# EAGLE design 5S (EAGLE 7.6.0)

## Sheet 1 of 2: uC
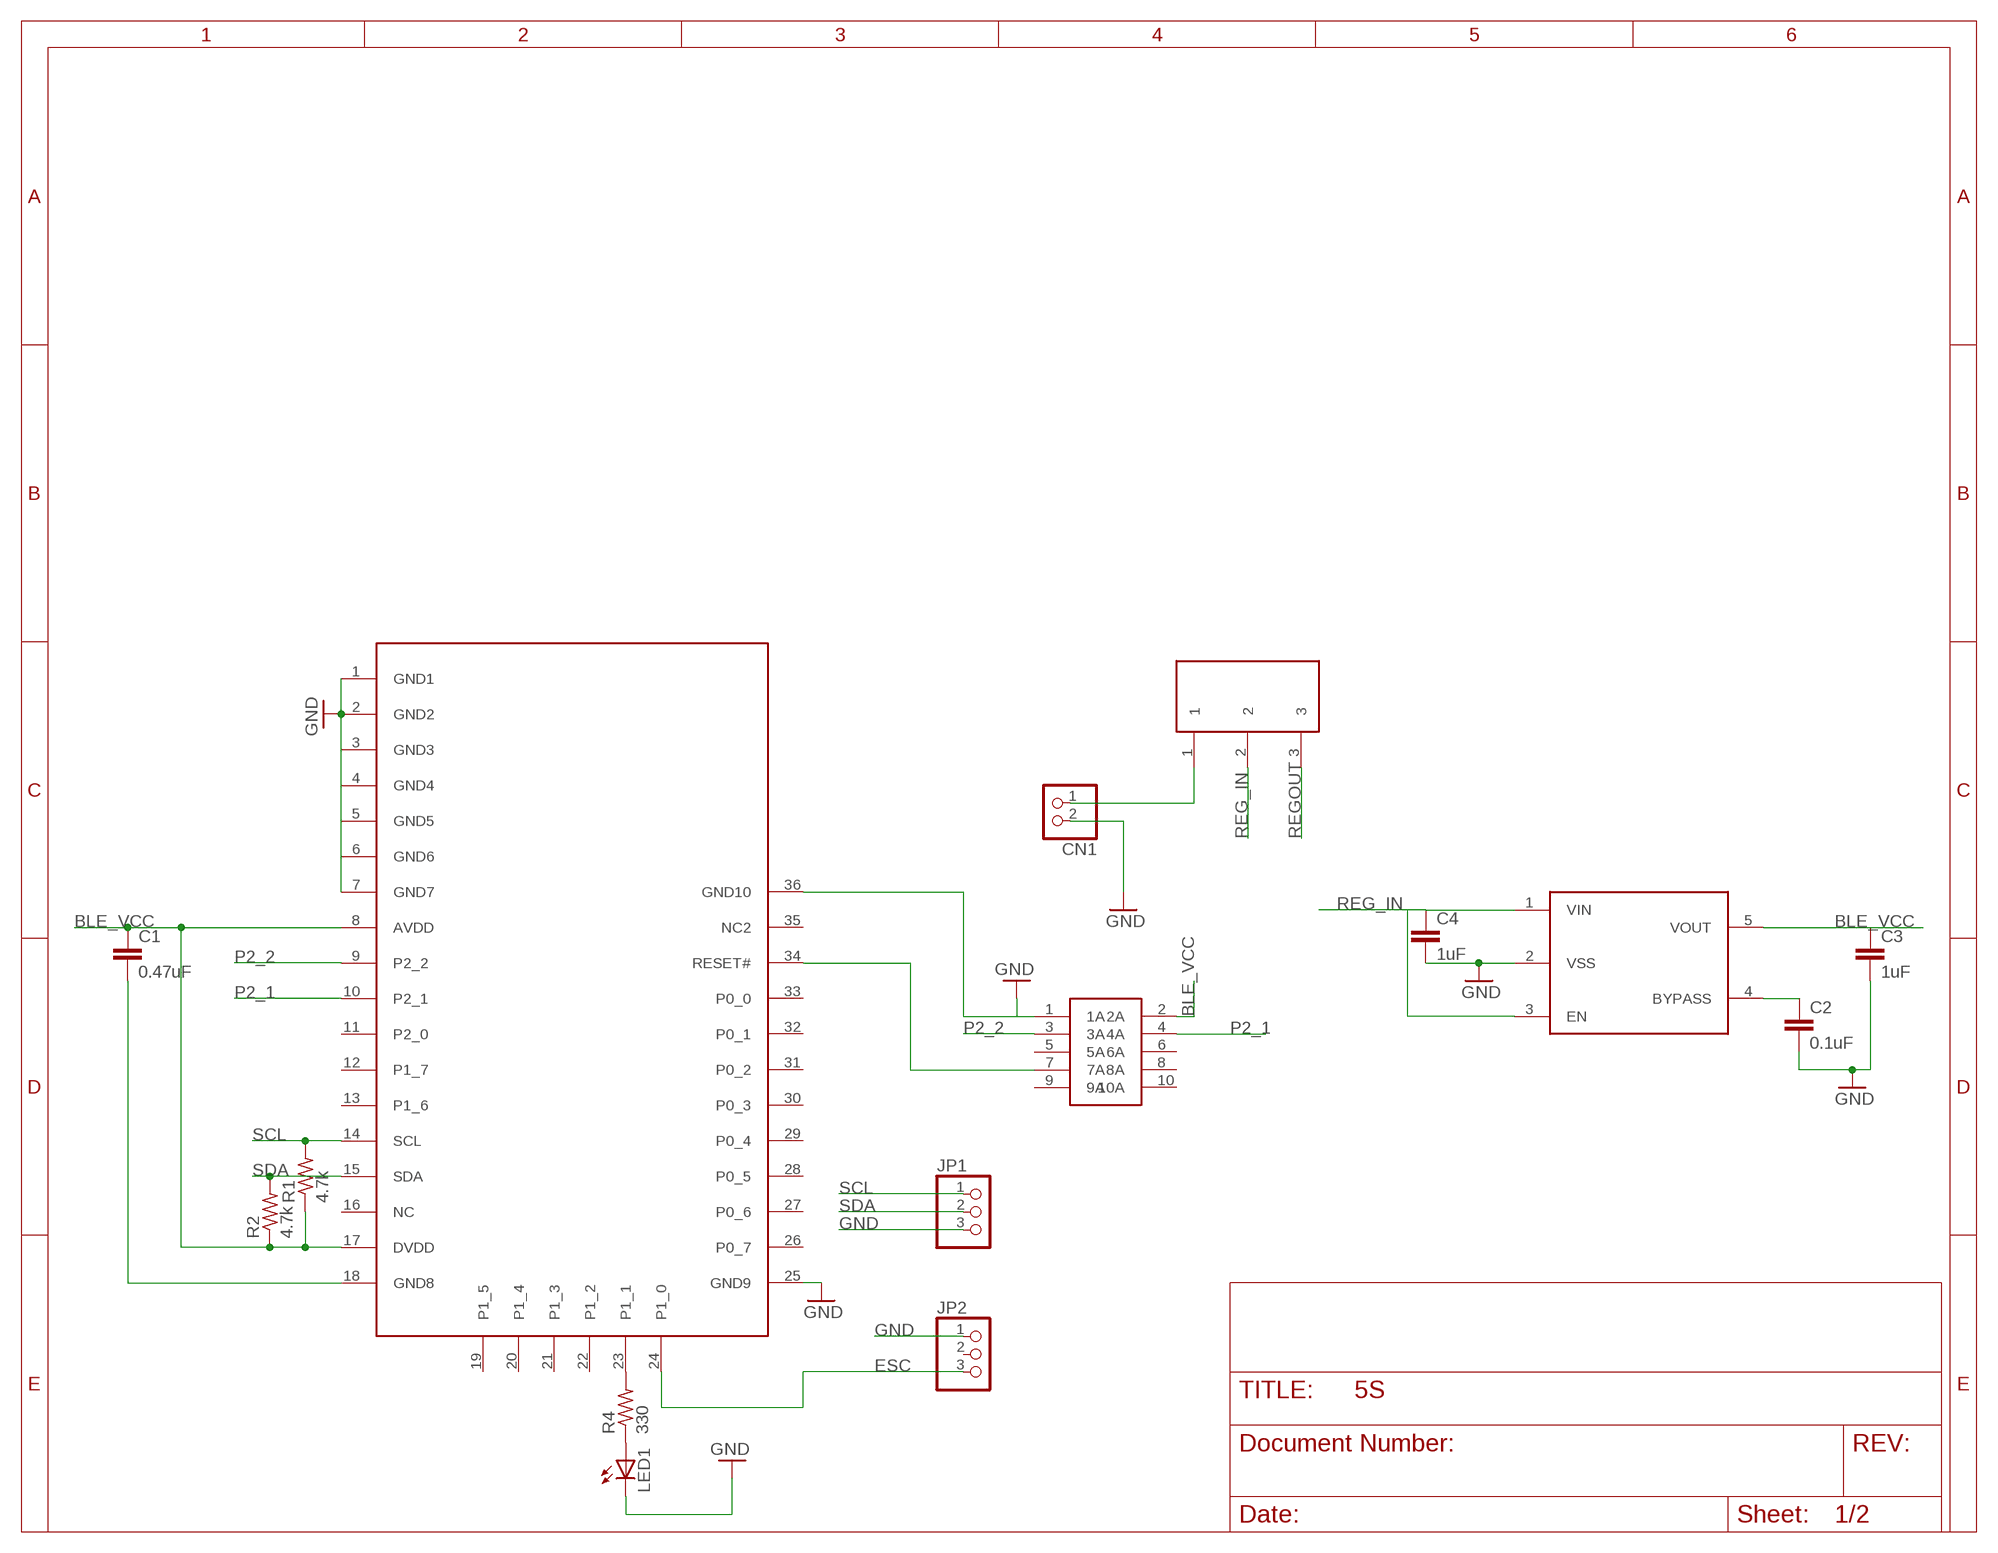
[diagram p0: schematic, sheet 1]

### Parts
C1  0.47uF  C-EUC0402  [C0402]
C2  0.1uF  C-EUC0402  [C0402]
C3  1uF  C-EUC0402  [C0402]
C4  1uF  C-EUC0402  [C0402]
CN1  JST_2PIN-THM  [JST-PH-2-THM]
JP1  PINHD-1X3  [1X03]
JP2  PINHD-1X3  [1X03]
LED1  LEDCHIP-LED0805  [CHIP-LED0805]
R1  4.7k  R-US_R0402  [R0402]
R2  4.7k  R-US_R0402  [R0402]
R4  330  R-US_R0402  [R0402]
U$1  BLE113  [BLUEGIGA]
U$2  RIBBON_10POS_MALE  [RIBBON_10POS_MALE]
U$4  SPDT_THRU  [SPDT_THRU]
U$5  LP3985  [SOT23-5L]

### Nets
BLE_VCC: C1.1 C3.1 R1.1 R2.1 U$1.8(AVDD) U$1.17(DVDD) U$2.2(2A) U$5.5(VOUT)
ESC: JP2.3 U$1.24(P1_0)
GND: C2.2 C3.2 C4.2 CN1.2 JP1.3 JP2.1 LED1.C U$1.1(GND1) U$1.2(GND2) U$1.3(GND3) U$1.4(GND4) U$1.5(GND5) U$1.6(GND6) U$1.7(GND7) U$1.25(GND9) U$1.36(GND10) U$2.1(1A) U$5.2(VSS) ; also sheet 2
N$1: U$1.34(RESET#) U$2.7(7A)
N$2: CN1.1 U$4.1
N$4: C1.2 U$1.18(GND8)
N$7: R4.2 U$1.23(P1_1)
N$8: C2.1 U$5.4(BYPASS)
N$9: LED1.A R4.1
P2_1: U$1.10(P2_1) U$2.4(4A)
P2_2: U$1.9(P2_2) U$2.3(3A)
REG_IN: C4.1 U$4.2 U$5.1(VIN) U$5.3(EN)
REGOUT: U$4.3 ; also sheet 2
SCL: JP1.1 R1.2 U$1.14(SCL) ; also sheet 2
SDA: JP1.2 R2.2 U$1.15(SDA) ; also sheet 2
Unconnected: JP2.2 U$1.11(P2_0) U$1.12(P1_7) U$1.13(P1_6) U$1.16(NC) U$1.19(P1_5) U$1.20(P1_4) U$1.21(P1_3) U$1.22(P1_2) U$1.26(P0_7) U$1.27(P0_6) U$1.28(P0_5) U$1.29(P0_4) U$1.30(P0_3) U$1.31(P0_2) U$1.32(P0_1) U$1.33(P0_0) U$1.35(NC2) U$2.5(5A) U$2.6(6A) U$2.8(8A) U$2.9(9A) U$2.10(10A)

## Sheet 2 of 2: Charge
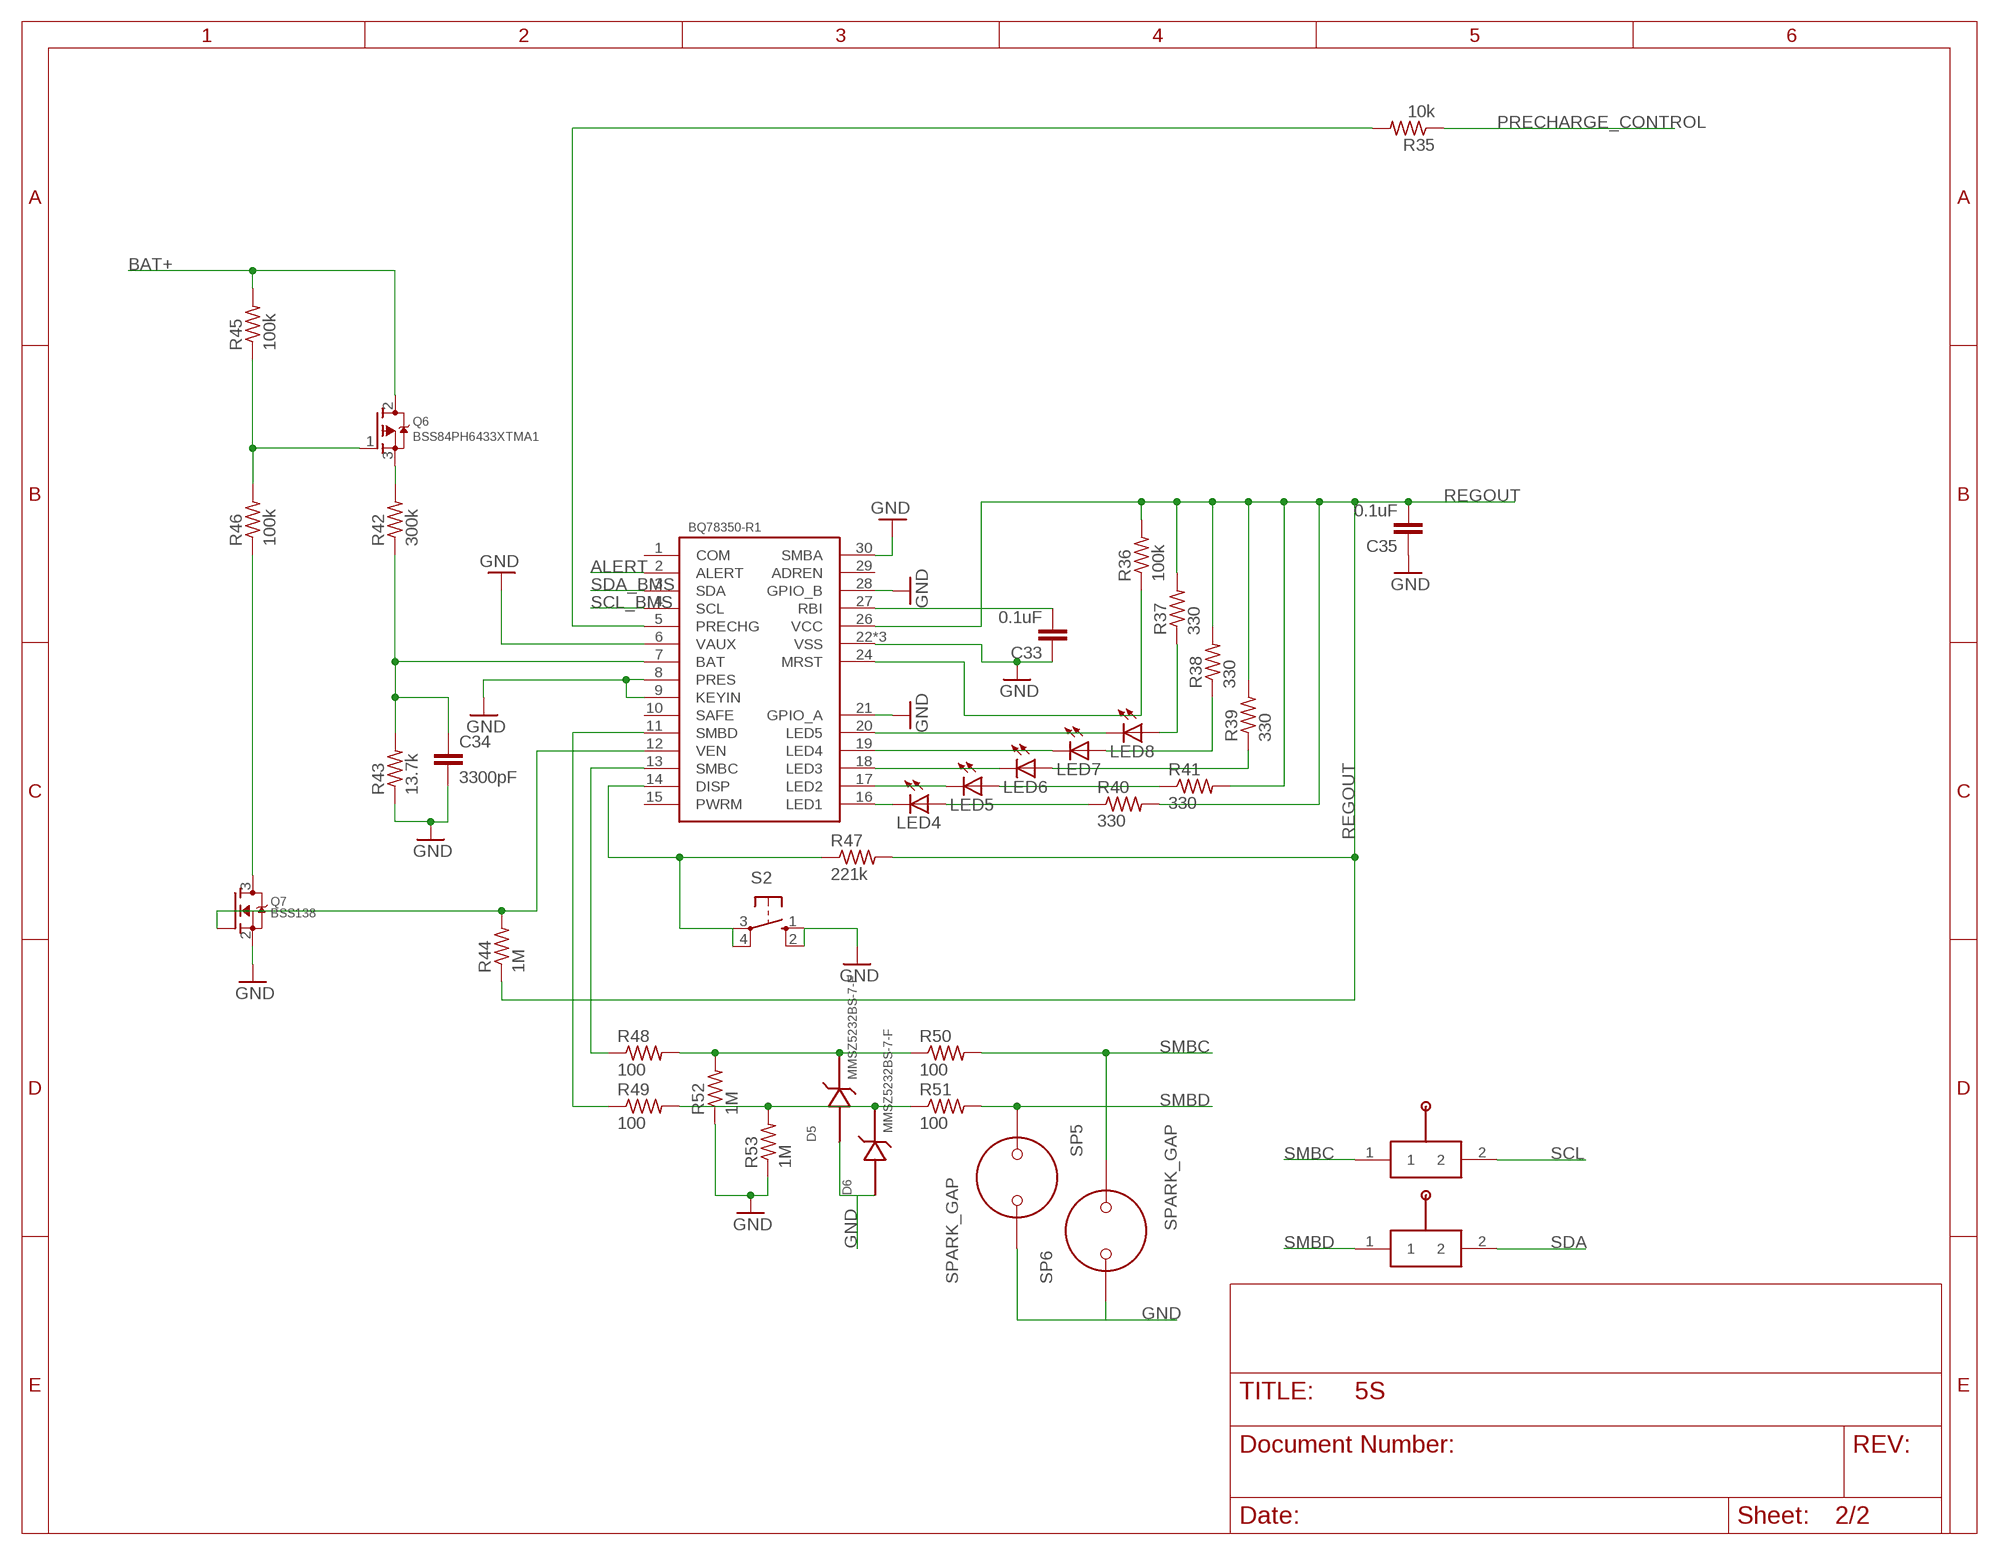
[diagram p1: schematic, sheet 2, part 1 of 2]
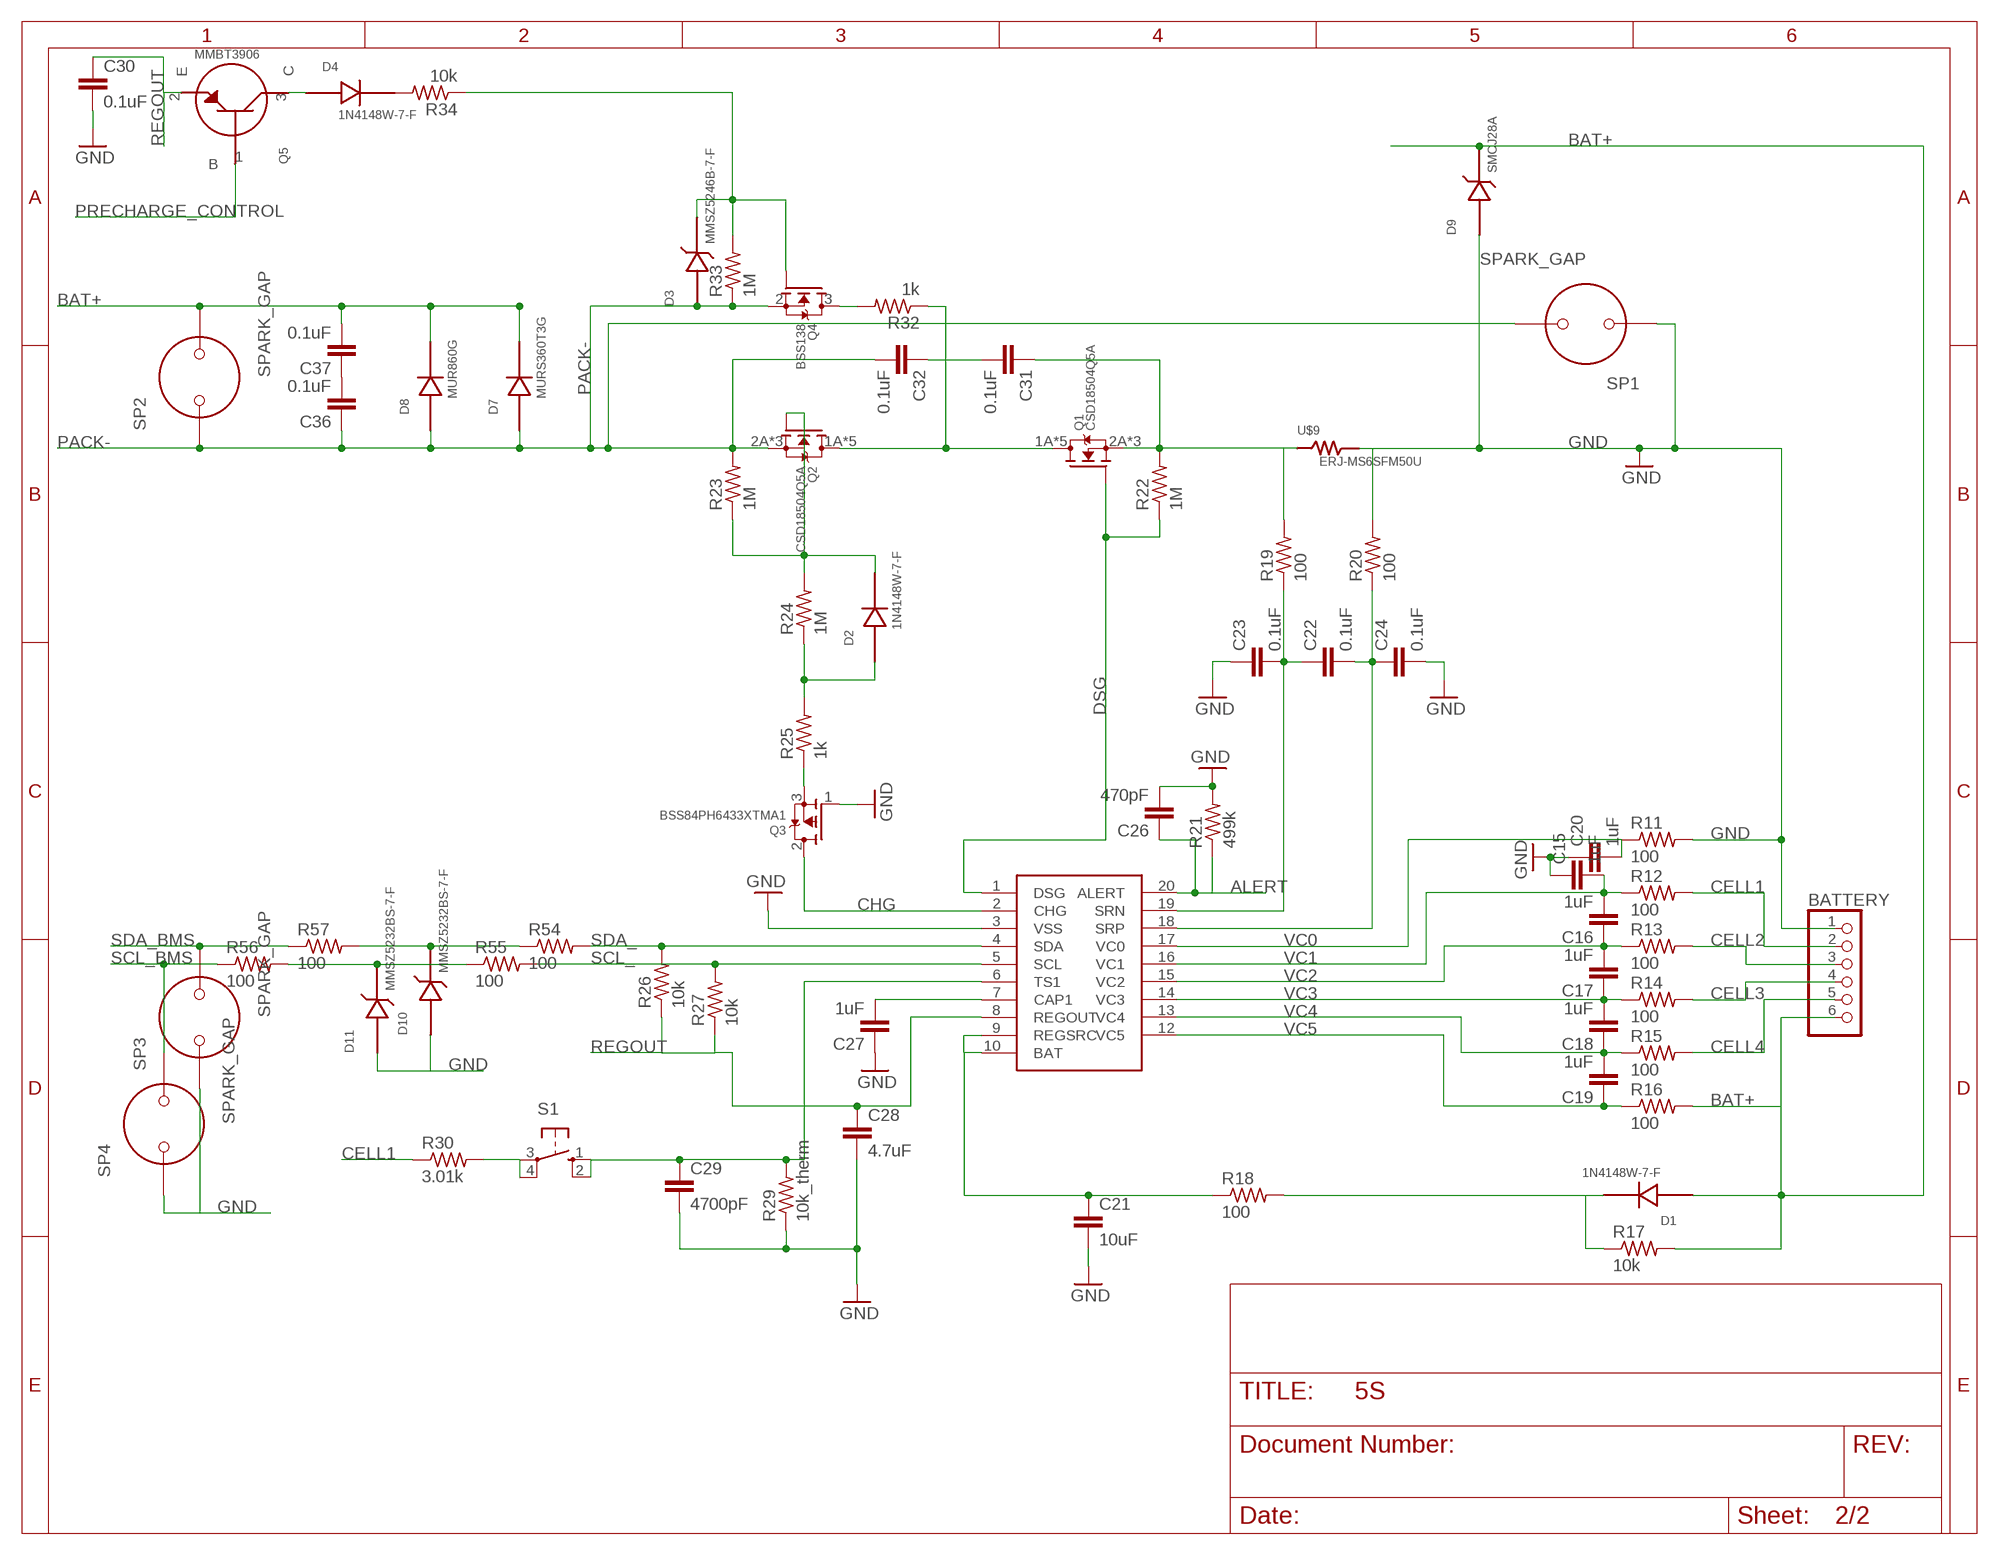
[diagram p2: schematic, sheet 2, part 2 of 2]

### Parts
BATTERY  PINHD-1X6  [1X06]
C15  1uF  C-EUC0805  [C0805]
C16  1uF  C-EUC0805  [C0805]
C17  1uF  C-EUC0805  [C0805]
C18  1uF  C-EUC0805  [C0805]
C19  1uF  C-EUC0805  [C0805]
C20  1uF  C-EUC0805  [C0805]
C21  10uF  C-EUC1206  [C1206]
C22  0.1uF  C-EUC0805  [C0805]
C23  0.1uF  C-EUC0805  [C0805]
C24  0.1uF  C-EUC0805  [C0805]
C26  470pF  C-EUC0805  [C0805]
C27  1uF  C-EUC0805  [C0805]
C28  4.7uF  C-EUC0805  [C0805]
C29  4700pF  C-EUC0402  [C0402]
C30  0.1uF  C-EUC0805  [C0805]
C31  0.1uF  C-EUC0805  [C0805]
C32  0.1uF  C-EUC0805  [C0805]
C33  0.1uF  C-EUC0805  [C0805]
C34  3300pF  C-EUC0402  [C0402]
C35  0.1uF  C-EUC0805  [C0805]
C36  0.1uF  C-EUC0805  [C0805]
C37  0.1uF  C-EUC0805  [C0805]
D1  1N4148W-7-F  [SOD-123]
D2  1N4148W-7-F  [SOD-123]
D3  MMSZ5246B-7-F  [SOD-123]
D4  1N4148W-7-F  [SOD-123]
D5  MMSZ5232BS-7-F  [SOD-323F]
D6  MMSZ5232BS-7-F  [SOD-323F]
D7  MURS360T3G  [SMC(DO-214AB)]
D8  MUR860G  [TO-220(2RA)]
D9  SMCJ28A  [SMC(DO-214AB)]
D10  MMSZ5232BS-7-F  [SOD-323F]
D11  MMSZ5232BS-7-F  [SOD-323F]
LED4  LEDCHIPLED_0805  [CHIPLED_0805]
LED5  LEDCHIPLED_0805  [CHIPLED_0805]
LED6  LEDCHIPLED_0805  [CHIPLED_0805]
LED7  LEDCHIPLED_0805  [CHIPLED_0805]
LED8  LEDCHIPLED_0805  [CHIPLED_0805]
Q1  CSD18504Q5A  [Q5A]
Q2  CSD18504Q5A  [Q5A]
Q3  BSS84PH6433XTMA1  [SOT23-3]
Q4  BSS138  [SOT23-3]
Q5  MMBT3906  [SOT23-3]
Q6  BSS84PH6433XTMA1  [SOT23-3]
Q7  BSS138  [SOT23-3]
R11  100  R-US_R1206  [R1206]
R12  100  R-US_R1206  [R1206]
R13  100  R-US_R1206  [R1206]
R14  100  R-US_R1206  [R1206]
R15  100  R-US_R1206  [R1206]
R16  100  R-US_R1206  [R1206]
R17  10k  R-US_R0805  [R0805]
R18  100  R-US_R0805  [R0805]
R19  100  R-US_R0805  [R0805]
R20  100  R-US_R0805  [R0805]
R21  499k  R-US_R0805  [R0805]
R22  1M  R-US_R1206  [R1206]
R23  1M  R-US_R1206  [R1206]
R24  1M  R-US_R1206  [R1206]
R25  1k  R-US_R0805  [R0805]
R26  10k  R-US_R0805  [R0805]
R27  10k  R-US_R0805  [R0805]
R29  10k_therm  R-US_R0402  [R0402]
R30  3.01k  R-US_R0805  [R0805]
R32  1k  R-US_R2512  [R2512]
R33  1M  R-US_R1206  [R1206]
R34  10k  R-US_R0805  [R0805]
R35  10k  R-US_R0805  [R0805]
R36  100k  R-US_R0805  [R0805]
R37  330  R-US_R0402  [R0402]
R38  330  R-US_R0402  [R0402]
R39  330  R-US_R0402  [R0402]
R40  330  R-US_R0402  [R0402]
R41  330  R-US_R0402  [R0402]
R42  300k  R-US_R0805  [R0805]
R43  13.7k  R-US_R0805  [R0805]
R44  1M  R-US_R1206  [R1206]
R45  100k  R-US_R0805  [R0805]
R46  100k  R-US_R0805  [R0805]
R47  221k  R-US_R0805  [R0805]
R48  100  R-US_R0805  [R0805]
R49  100  R-US_R0805  [R0805]
R50  100  R-US_R0805  [R0805]
R51  100  R-US_R0805  [R0805]
R52  1M  R-US_R1206  [R1206]
R53  1M  R-US_R1206  [R1206]
R54  100  R-US_R0805  [R0805]
R55  100  R-US_R0805  [R0805]
R56  100  R-US_R0805  [R0805]
R57  100  R-US_R0805  [R0805]
S1  10-XX  [B3F-10XX]
S2  10-XX  [B3F-10XX]
SP1  SPARK_GAP  [SPARK_GAP]
SP2  SPARK_GAP  [SPARK_GAP]
SP3  SPARK_GAP  [SPARK_GAP]
SP4  SPARK_GAP  [SPARK_GAP]
SP5  SPARK_GAP  [SPARK_GAP]
SP6  SPARK_GAP  [SPARK_GAP]
U$3  BQ76920  [SOIC-20]
U$9  ERJ-MS6SFM50U  [ERJ-MS6SFM50U]
U$10  BQ78350-R1  [SOIC-30]
U$16  MANUAL_SWITCH  [MANUAL_SWITCH]
U$17  MANUAL_SWITCH  [MANUAL_SWITCH]

### Nets
ALERT: C26.1 R21.1 U$3.20(ALERT) U$10.2(ALERT)
BAT+: BATTERY.6 C37.2 D1.P$1 D7.2 D8.P$3 D9.2 Q6.2(S) R16.2 R17.2 R45.2 SP2.P$2
CELL1: BATTERY.2 R12.2 R30.1
CELL2: BATTERY.3 R13.2
CELL3: BATTERY.4 R14.2
CELL4: BATTERY.5 R15.2
CHG: Q3.2(S) U$3.2(CHG)
DSG: Q1.3A(G) R22.1 U$3.1(DSG)
GND: BATTERY.1 C15.1 C20.1 C21.2 C23.1 C24.2 C26.2 C27.1 C28.2 C29.2 C30.2 C33.1 C34.2 C35.1 D5.1 D6.1 D9.1 D10.1 D11.1 Q3.1(G) Q7.2(S) R11.2 R20.2 R21.2 R29.1 R43.1 R52.1 R53.1 S2.1(S) S2.2(S1) SP1.P$1 SP3.P$1 SP4.P$1 SP5.P$2 SP6.P$1 U$3.3(VSS) U$9.2 U$10.6(VAUX) U$10.8(PRES) U$10.9(KEYIN) U$10.21(GPIO_A) U$10.22(VSS) U$10.23(VSS) U$10.25(VSS) U$10.28(GPIO_B) U$10.30(SMBA) ; also sheet 1
N$15: C21.1 R18.1 U$3.9(REGSRC) U$3.10(BAT)
N$16: C22.2 C24.1 R20.1 U$3.18(SRP)
N$17: D1.P$2 R17.1 R18.2
N$18: D11.2 R55.1 R56.2
N$19: C31.1 Q1.2A(S) Q1.2B(S) Q1.2C(S) R19.2 R22.2 U$9.1
N$20: C22.1 C23.2 R19.1 U$3.19(SRN)
N$21: C27.2 U$3.7(CAP1)
N$22: Q4.3(D) R32.2
N$23: D4.P$2 R34.2
N$24: D3.P$2 Q4.1(G) R33.2 R34.1
N$25: D4.P$1 Q5.3(C)
N$27: D2.P$1 R24.1 R25.2
N$28: Q1.1A(D) Q1.1B(D) Q1.1C(D) Q1.1D(D) Q1.1E(D) Q2.1A(D) Q2.1B(D) Q2.1C(D) Q2.1D(D) Q2.1E(D) R32.1
N$29: C36.2 C37.1
N$30: D2.P$2 Q2.3A(G) R23.1 R24.2
N$31: Q3.3(D) R25.1
N$32: R30.2 S1.3(P) S1.4(P1)
N$33: C29.1 R29.2 S1.1(S) S1.2(S1) U$3.6(TS1)
N$35: C31.2 C32.1
N$36: C33.2 U$10.27(RBI)
N$37: R35.2 U$10.5(PRECHG)
N$38: R36.1 U$10.24(MRST)
N$39: Q7.3(D) R46.1
N$40: LED8.C U$10.20(LED5)
N$41: LED7.C U$10.19(LED4)
N$42: LED6.C U$10.18(LED3)
N$43: LED5.C U$10.17(LED2)
N$44: LED4.C U$10.16(LED1)
N$45: LED4.A R40.1
N$46: LED5.A R41.1
N$47: LED6.A R39.1
N$48: LED7.A R38.1
N$49: LED8.A R37.1
N$50: C34.1 R42.1 R43.2 U$10.7(BAT)
N$51: Q7.1(G) R44.2 U$10.12(VEN)
N$52: Q6.3(D) R42.2
N$53: Q6.1(G) R45.1 R46.2
N$54: R48.1 U$10.13(SMBC)
N$55: R47.1 S2.3(P) S2.4(P1) U$10.14(DISP)
N$56: R49.1 U$10.11(SMBD)
N$57: D5.2 R48.2 R50.1 R52.2
N$58: D6.2 R49.2 R51.1 R53.2
N$59: D10.2 R54.1 R57.2
PACK-: C32.2 C36.1 D3.P$1 D7.1 D8.P$1 Q2.2A(S) Q2.2B(S) Q2.2C(S) Q4.2(S) R23.2 R33.1 SP1.P$2 SP2.P$1
PRECHARGE_CONTROL: Q5.1(B) R35.1
REGOUT: C28.1 C30.1 C35.2 Q5.2(E) R26.1 R27.1 R36.2 R37.2 R38.2 R39.2 R40.2 R41.2 R44.1 R47.2 U$3.8(REGOUT) U$10.26(VCC) ; also sheet 1
SCL: U$16.2 ; also sheet 1
SCL_: R27.2 R55.2 U$3.5(SCL)
SCL_BMS: R56.1 SP4.P$2 U$10.4(SCL)
SDA: U$17.2 ; also sheet 1
SDA_: R26.2 R54.2 U$3.4(SDA)
SDA_BMS: R57.1 SP3.P$2 U$10.3(SDA)
SMBC: R50.2 SP6.P$2 U$16.1
SMBD: R51.2 SP5.P$1 U$17.1
VC0: C20.2 R11.1 U$3.17(VC0)
VC1: C15.2 C16.2 R12.1 U$3.16(VC1)
VC2: C16.1 C17.2 R13.1 U$3.15(VC2)
VC3: C17.1 C18.2 R14.1 U$3.14(VC3)
VC4: C18.1 C19.2 R15.1 U$3.13(VC4)
VC5: C19.1 R16.1 U$3.12(VC5)
Unconnected: U$10.1(COM) U$10.10(SAFE) U$10.15(PWRM) U$10.29(ADREN)

## Library data of the parts
BATTERY = adafruit:PINHD-1X6: PIN HEADER
C1-C4 C15-C24 C26-C37 = rcl:C-EU: CAPACITOR, European symbol
CN1 = adafruit:JST_2PIN: JST 2-Pin Connectors of various flavors SMT-RA (S2B-PH-SM4) 4UConnector #17311 SMT (B2B-PH-SM4) THM-RA (S2B-PH) THM (B2B-PH)
D1 D2 D4 = Charles:1N4148W-7-F: DIODE GENERAL PURPOSE 100V 300MA
D3 = Charles:MMSZ5246B-7-F: ZENER DIODE 16V 500MW
D5 D6 D10 D11 = Charles:MMSZ5232BS-7-F: ZENER DIODE 5.6V 200MW
D7 = Charles:MURS360T3G: Ultrafast Power Rectifier, Diode General Purpose 600V 3A
D8 = Charles:MUR860G: DIODE GENERAL PURPOSE 600V 8A - SWITCH MODE POWER RECTIFIER
D9 = Charles:SMCJ28A: Zener Diode - 1500 Watt Transient Voltage Suppressor - 28VWM 45.4VC - Fairchild-Semiconductor
JP1 JP2 = adafruit:PINHD-1X3: PIN HEADER
LED1 LED4-LED8 = adafruit:LED: LED OSRAM: - CHIPLED LG R971, LG N971, LY N971, LG Q971, LY Q971, LO R971, LY R971 LH N974, LH R974 LS Q976, LO Q976, LY Q976 LO Q996 - Hyper CHIPLED LW Q18S LB Q993, LB Q99A, LB R99A - SideLED LS A670, LO A670, LY A670, LG A670, LP A670 LB A673, LV A673, LT A673, LW A673 LH A674 LY A675 LS A676, LA A676, LO A676, LY A676, LW A676 LS A679, LY A679, LG A679 - Hyper Micro SIDELED® LS Y876, LA Y876, LO Y876, LY Y876 LT Y87S - SmartLED LW L88C, LW L88S LB L89C, LB L89S, LG L890 LS L89K, LO L89K, LY L89K LS L896, LA L896, LO L896, LY L896 - TOPLED LS T670, LO T670, LY T670, LG T670, LP T670 LSG T670, LSP T670, LSY T670, LOP T670, LYG T670 LG T671, LOG T671, LSG T671 LB T673, LV T673, LT T673, LW T673 LH T674 LS T676, LA T676, LO T676, LY T676, LB T676, LH T676, LSB T676, LW T676 LB T67C, LV T67C, LT T67C, LS T67K, LO T67K, LY T67K, LW E67C LS E67B, LA E67B, LO E67B, LY E67B, LB E67C, LV E67C, LT E67C LW T67C LS T679, LY T679, LG T679 LS T770, LO T770, LY T770, LG T770, LP T770 LB T773, LV T773, LT T773, LW T773 LH T774 LS E675, LA E675, LY E675, LS T675 LS T776, LA T776, LO T776, LY T776, LB T776 LHGB T686 LT T68C, LB T68C - Hyper Mini TOPLED® LB M676 - Mini TOPLED Santana® LG M470 LS M47K, LO M47K, LY M47K Source: http://www.osram.convergy.de/
Q1 Q2 = Charles:CSD18504Q5A: 40-V N-Channel NexFET Power MOSFET
Q3 Q6 = Charles:BSS84PH6433XTMA1: MOSFET P-Channel 60V 170MA SOT-23
Q4 Q7 = Charles:BSS138: MOSFET N-CH 50V 220MA
Q5 = Charles:MMBT3906: TRANSISTOR PNP 40V 0.2A
R1 R2 R4 R11-R27 R29 R30 R32-R57 = rcl:R-US_: RESISTOR, American symbol
S1 S2 = switch-omron:10-XX: OMRON SWITCH; MPN: B3F-1000; OC_FARNELL: 176432; OC_NEWARK: 36M3542
SP1-SP6 = Charles:SPARK_GAP: Spark Gap 0.2mm ~2kV for ESD Protection
U$1 = James_Updated:BLE113
U$2 = James_Updated:RIBBON_10POS_MALE
U$3 = Charles:BQ76920: 3-Series to 5-Series Cell Battery Monitor Family for Li-Ion and Phosphate Applications
U$4 = James_Updated:SPDT_THRU
U$5 = James_Updated:LP3985
U$9 = Charles:ERJ-MS6SFM50U: Shunt Resistor (R2526)
U$10 = Charles:BQ78350-R1: CEDV Li-Ion Gas Gauge and Battery Management Controller Companion to the BQ769x0 Battery Monitoring AFE
U$16 U$17 = James_Updated:MANUAL_SWITCH

## Board
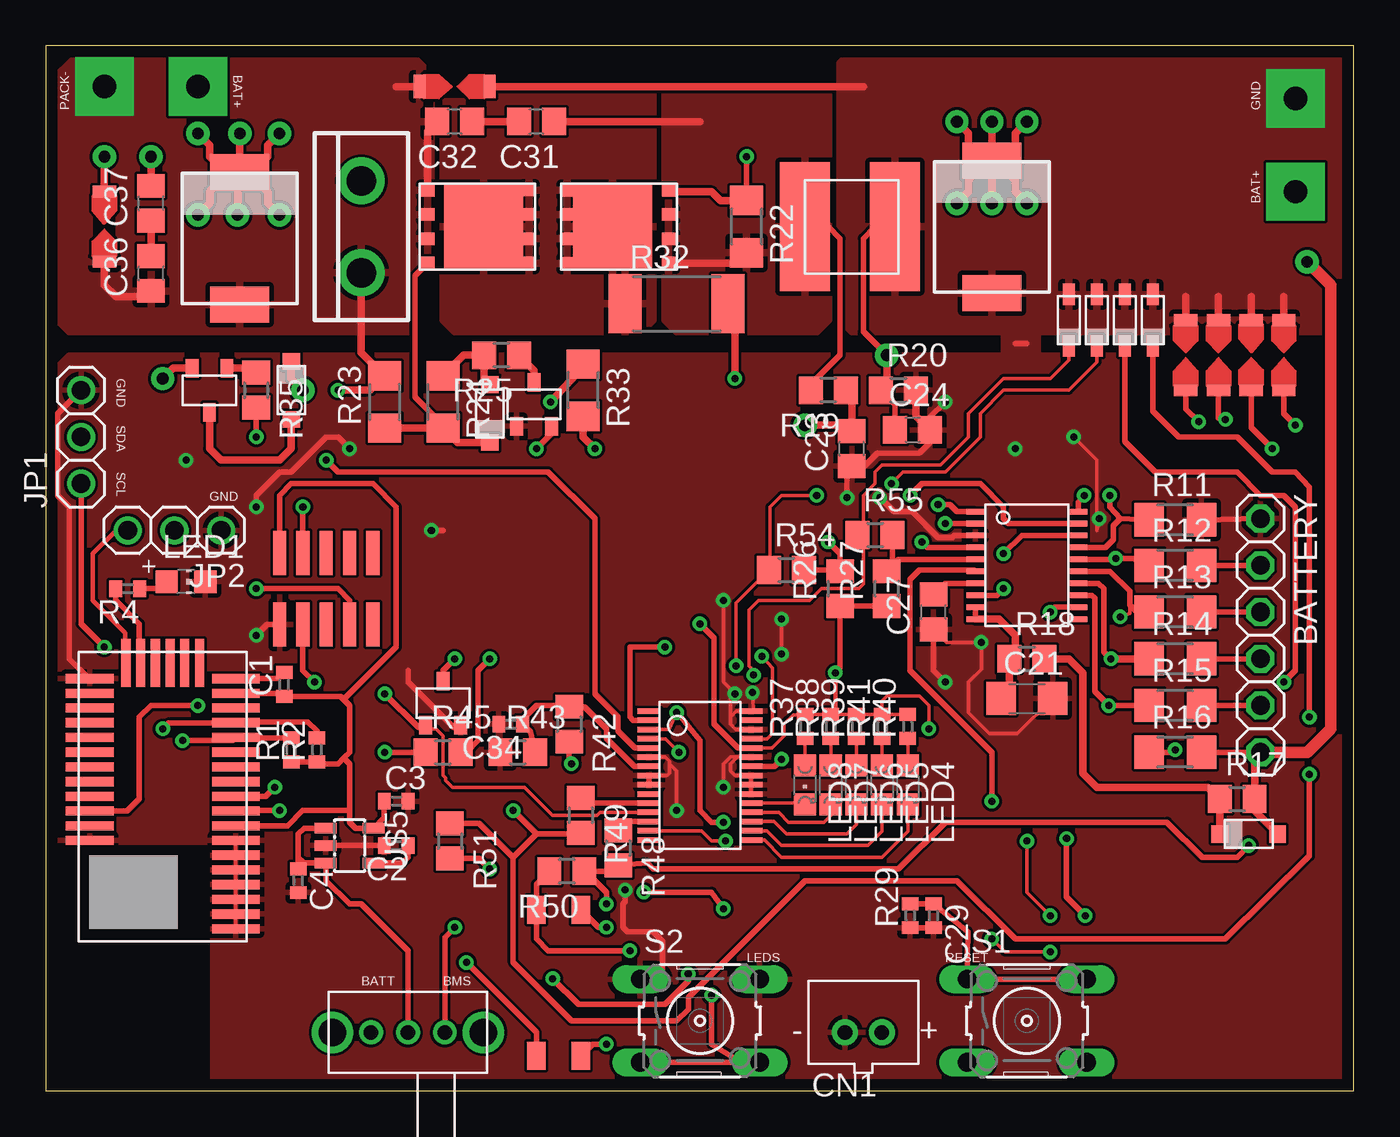
[diagram p3: board, top side]
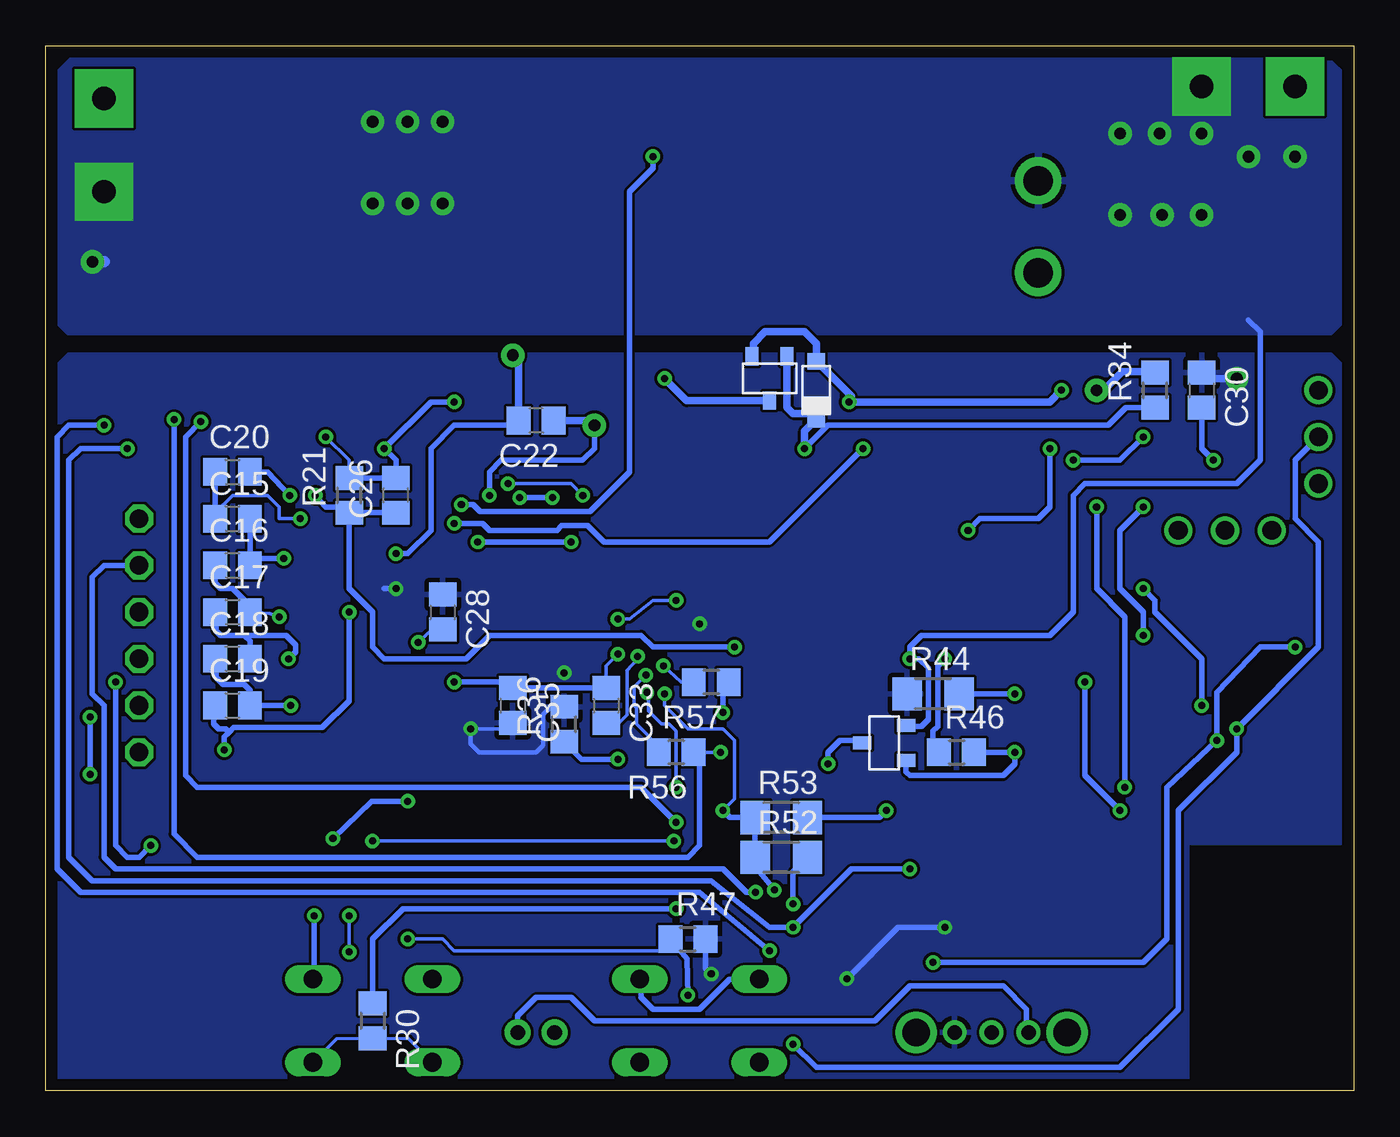
[diagram p4: board, bottom side, seen from below]

Size 71.1 x 56.82 mm. Coordinates in mm from the lower left corner, seen from the top.
Outline: 0,0 71.1,0 71.1,56.82 0,56.82 0,0
Copper layers (1*16): Top 0.035mm / dielectric 1.5mm / Bottom 0.035mm
Design rules "DRC_rules": minimum track width 8mil, minimum drill 15mil, track to track 6mil, track to pad 6mil, pad to pad 6mil, via to via 6mil, smd to smd 6mil, copper to edge 25mil, drill to drill 6mil, minimum pad ring 10mil, minimum via ring 8mil, stop-mask expansion 4mil, vias tented up to drill 0mil, thermal gap 10mil
tRestrict: area 0,0 to 8.9,13.3
bRestrict: area 0,0 to 8.9,13.3

### Footprints (pad centres in the part's own frame; a part is rotated, then mirrored left to right if it is on the bottom)
1X06 = drill 1.016 octagon: 1 -6.35,0; 2 -3.81,0; 3 -1.27,0; 4 1.27,0; 5 3.81,0; 6 6.35,0
C0402 = smd 0.7 x 0.9: 1 -0.65,0; 2 0.65,0
C0805 = smd 1.3 x 1.5: 1 -0.95,0; 2 0.95,0
C1206 = smd 1.6 x 1.8: 1 -1.4,0; 2 1.4,0
JST-PH-2-THM = drill 0.8 pad 1.422: 1 1,0; 2 -1,0
SOD-123 = smd 0.9 x 0.95: P$1 -1.575,0; P$2 1.575,0
SOD-323F = smd 0.65 x 1.15: 1 0,1.4; 2 0,-1.4
SMC(DO-214AB) = smd 1.96 x 3.2: 1 -3.6,0; 2 3.6,0
TO-220(2RA) = drill 1.6 pad 2.54: P$1 -2.5,0; P$3 2.5,0
1X03 = drill 1.016: 1 -2.54,0; 2 0,0; 3 2.54,0
CHIP-LED0805 = smd 1.2 x 1.2: A 0,-1.05; C 0,1.05
CHIPLED_0805 = smd 1.2 x 1.2: A 0,-1.05; C 0,1.05
Q5A = smd 0.66 x 0.686: 1A -2.781,1.981; 1B -2.781,0.66; 1C -2.781,-0.66; 1D -2.781,-2 | smd 4.293 x 4.648: 1E -0.305,0 | smd 0.749 x 0.686: 2A 2.75,0.66; 2B 2.75,-0.66; 2C 2.75,-1.981; 3A 2.75,1.981
SOT23-3 = smd 0.7 x 1: 1 -0.95,-1.2; 2 0.95,-1.2; 3 0,1.2
R0402 = smd 0.7 x 0.9: 1 -0.65,0; 2 0.65,0
R1206 = smd 1.6 x 1.803: 1 -1.422,0; 2 1.422,0
R0805 = smd 1.3 x 1.5: 1 -0.95,0; 2 0.95,0
R2512 = smd 1.8 x 3.2: 1 -2.8,0; 2 2.8,0
B3F-10XX = drill 1.016 long: 1 -3.251,2.261; 2 3.251,2.261; 3 -3.251,-2.261; 4 3.251,-2.261
SPARK_GAP = smd 1.27 x 0.635: P$1 0,1.905; P$2 0,-1.905
BLUEGIGA = smd 2.6 x 0.5: 1 -3.975,9.6; 2 -3.975,8.8; 3 -3.975,8; 4 -3.975,7.2; 5 -3.975,6.4; 6 -3.975,5.6; 7 -3.975,4.8; 8 -3.975,4; 9 -3.975,3.2; 10 -3.975,2.4; 11 -3.975,1.6; 12 -3.975,0.8; 13 -3.975,0; 14 -3.975,-0.8; 15 -3.975,-1.6; 16 -3.975,-2.4; 17 -3.975,-3.2; 18 -3.975,-4; 25 3.975,-4; 26 3.975,-3.2; 27 3.975,-2.4; 28 3.975,-1.6; 29 3.975,-0.8; 30 3.975,0; 31 3.975,0.8; 32 3.975,1.6; 33 3.975,2.4; 34 3.975,3.2; 35 3.975,4; 36 3.975,4.8 | smd 0.5 x 2.6: 19 -2,-4.85; 20 -1.2,-4.85; 21 -0.4,-4.85; 22 0.4,-4.85; 23 1.2,-4.85; 24 2,-4.85
RIBBON_10POS_MALE = smd 0.72 x 2.4: 1 -5.08,-1.95; 2 -5.08,1.95; 3 -3.81,-1.95; 4 -3.81,1.95; 5 -2.54,-1.95; 6 -2.54,1.95; 7 -1.27,-1.95; 8 -1.27,1.95; 9 0,-1.95; 10 0,1.95
SOIC-20 = smd 0.3 x 1: 1 -2.925,-2.8; 2 -2.275,-2.8; 3 -1.625,-2.8; 4 -0.975,-2.8; 5 -0.325,-2.8; 6 0.325,-2.8; 7 0.975,-2.8; 8 1.625,-2.8; 9 2.275,-2.8; 10 2.925,-2.8; 11 2.925,2.8; 12 2.275,2.8; 13 1.625,2.8; 14 0.975,2.8; 15 0.325,2.8; 16 -0.325,2.8; 17 -0.975,2.8; 18 -1.625,2.8; 19 -2.275,2.8; 20 -2.925,2.8
SPDT_THRU = drill 0.787: 1 -2.007,0; 2 0,0; 3 2.007,0 | drill 1.499: A1 -4.102,0; A2 4.102,0
SOT23-5L = smd 0.55 x 1.2: 1 -0.95,-1.3; 2 0,-1.3; 3 0.95,-1.3; 4 0.95,1.3; 5 -0.95,1.3
ERJ-MS6SFM50U = smd 2.7 x 7: 1 -2.54,0; 2 2.35,0
SOIC-30 = smd 0.3 x 1.25: 1 -3.5,-2.775; 2 -3,-2.775; 3 -2.5,-2.775; 4 -2,-2.775; 5 -1.5,-2.775; 6 -1,-2.775; 7 -0.5,-2.775; 8 0,-2.775; 9 0.5,-2.775; 10 1,-2.775; 11 1.5,-2.775; 12 2,-2.775; 13 2.5,-2.775; 14 3,-2.775; 15 3.5,-2.775; 16 3.5,2.775; 17 3,2.775; 18 2.5,2.775; 19 2,2.775; 20 1.5,2.775; 21 1,2.775; 22 0.5,2.775; 23 0,2.775; 24 -0.5,2.775; 25 -1,2.775; 26 -1.5,2.775; 27 -2,2.775; 28 -2.5,2.775; 29 -3,2.775; 30 -3.5,2.775
MANUAL_SWITCH = smd 1.524 x 1.016: 1 -4.13,0; 2 3.81,0

### Placement (x,y rotation side)
BATTERY  66.04,24.77 270 top
C1  12.95,22.1 90 top
C2  19.05,13.34 180 top
C3  19.05,15.75 0 top
C4  13.72,11.43 270 top
C15  60.96,31.11 0 bottom
C16  60.96,28.57 0 bottom
C17  60.96,26.04 0 bottom
C18  60.96,23.5 0 bottom
C19  60.96,20.95 0 bottom
C20  60.96,33.66 0 bottom
C21  53.34,21.34 0 top
C22  44.45,36.45 180 bottom
C23  43.81,34.92 90 top
C24  47.12,35.94 0 top
C26  52.07,32.38 90 bottom
C27  48.26,26.04 90 top
C28  49.53,26.04 270 bottom
C29  48.26,9.53 270 top
C30  8.26,38.1 270 bottom
C31  26.67,52.7 180 top
C32  22.23,52.7 180 top
C33  40.64,20.95 270 bottom
C34  25.27,19.94 180 top
C35  45.72,20.95 270 bottom
C36  5.71,44.45 90 top
C37  5.71,48.26 90 top
CN1  44.45,3.17 0 top
D1  65.41,13.97 180 top
D2  24.13,36.83 270 top
D3  29.21,38.1 270 bottom
D4  13.34,38.1 90 top
D5  58.67,41.91 0 top
D6  60.2,41.91 0 top
D7  10.54,46.35 90 top
D8  17.14,46.99 90 top
D9  51.44,46.99 90 top
D10  57.15,41.91 0 top
D11  55.63,41.91 0 top
JP1  1.91,35.56 90 top
JP2  6.99,30.48 180 top
LED1  7.62,27.69 270 top
LED4  46.86,16.64 180 top
LED5  45.47,16.64 180 top
LED6  44.07,16.64 180 top
LED7  42.67,16.64 180 top
LED8  41.27,16.64 180 top
Q1  31.11,46.99 0 top
Q2  23.5,46.99 180 top
Q3  26.54,37.34 0 top
Q4  31.75,38.73 180 bottom
Q5  8.89,38.1 180 top
Q6  25.53,18.92 90 bottom
Q7  21.59,21.08 0 top
R1  13.34,18.54 90 top
R2  14.73,18.54 90 top
R4  4.45,27.3 180 top
R11  61.4,31.05 0 top
R12  61.4,28.57 0 top
R13  61.4,26.04 0 top
R14  61.4,23.5 0 top
R15  61.4,20.95 0 top
R16  61.4,18.41 0 top
R17  64.77,15.88 0 top
R18  53.34,23.5 0 top
R19  42.55,38.1 180 top
R20  46.35,38.1 0 top
R21  54.61,32.38 90 bottom
R22  38.1,46.99 270 top
R23  18.41,37.47 90 top
R24  21.59,37.47 270 top
R25  24.77,40.01 180 top
R26  43.18,27.3 90 top
R27  45.72,27.3 90 top
R29  46.99,9.53 90 top
R30  53.34,3.81 270 bottom
R32  34.29,42.8 0 top
R33  29.21,38.1 270 top
R34  10.79,38.1 90 bottom
R35  11.43,38.1 270 top
R36  42.93,19.94 90 bottom
R37  41.27,19.81 90 top
R38  42.67,19.81 90 top
R39  44.07,19.81 90 top
R40  46.86,19.81 90 top
R41  45.47,19.81 90 top
R42  28.45,19.94 270 top
R43  25.65,18.41 0 top
R44  22.86,21.59 0 bottom
R45  21.59,18.41 0 top
R46  21.59,18.41 0 bottom
R47  36.2,8.26 0 bottom
R48  31.11,13.21 270 top
R49  29.08,14.99 270 top
R50  28.32,11.94 180 top
R51  21.97,13.59 270 top
R52  31.11,12.7 0 bottom
R53  31.11,14.86 0 bottom
R54  40.26,28.32 0 top
R55  45.09,30.23 0 top
R56  36.83,18.41 180 bottom
R57  34.92,22.23 180 bottom
S1  53.34,3.81 0 top
S2  35.56,3.81 0 top
SP1  22.23,54.61 270 top
SP2  3.17,46.99 180 top
SP3  61.98,40.01 0 top
SP4  63.75,40.01 0 top
SP5  65.53,40.01 180 top
SP6  67.31,40.01 0 top
U$1  6.35,18.41 180 top
U$2  17.78,27.3 0 top
U$3  53.34,28.57 270 top
U$4  19.68,3.17 0 top
U$5  16.51,13.34 270 top
U$9  43.81,46.99 0 top
U$10  35.56,17.14 270 top
U$16  26.67,5.71 270 top
U$17  29.08,5.71 270 top

### Tracks (layer width: path | path; a pad name or v marks a point on that pad's centre or on a via)
ALERT  (via drill 0.38)
  Top 0.305: U$3.20 56.14,32.01 v56.45,32.38 | U$10.2 31.93,20.14 31.75,20.32 31.75,24.13 v33.66,24.13
  Bottom 0.305: C26.1 R21.1 | v56.45,32.38 55.88,31.75 54.92,31.75 R21.1 | v33.66,24.13 38.1,24.13 38.73,24.77 46.99,24.77 48.26,23.5 52.7,23.5 53.34,24.13 53.34,26.04 54.61,27.3 R21.1
BAT+  (via drill 0.38, 0.64 pad 1.27, 1.27 pad 3.17)
  Top 0.305: R16.2 BATTERY.6 | R45.2 22.86,18.41 23.5,19.05 23.5,22.86 v24.13,23.5
  Top 0.406: SP2.P$2 v3.17,50.8 | C37.2 v5.71,50.8 | 10.79,50.21 D7.2 9.73,49.95 8.89,50.8 8.89,51.44 v8.26,52.07 | 51.44,50.8 v51.44,52.7 | 51.44,50.8 50.8,50.8 50.16,51.44 50.16,52.07 v49.53,52.7 | 51.44,50.8 52.07,50.8 52.7,51.44 52.7,52.07 v53.34,52.7 | v10.54,52.07 10.54,50.16 11.43,50.16 12.06,50.8 12.06,51.44 v12.7,52.07 | 10.16,49.49 10.41,49.74 11.22,49.74 12.06,48.9 12.06,48.26 v12.7,47.62 | v10.41,47.62 10.41,49.53 9.53,49.53 8.89,48.9 8.89,48.26 v8.26,47.62 | 51.44,50.16 v51.44,48.26 | 51.44,50.16 52.07,50.16 52.7,49.53 52.7,48.9 v53.34,48.26 | 51.44,50.16 50.8,50.16 50.16,49.53 50.16,48.9 v49.53,48.26 | 51.44,50.8 D9.2 | D1.P$1 65.72,15.23 R17.2 65.72,18.09 BATTERY.6
  Top 0.635: BATTERY.6 68.58,18.41 69.85,19.68 69.85,43.81 v68.58,45.09
  Bottom 0.305: 24.52,19.68 Q6.2 24.27,19.81 23.5,19.81 23.11,20.19 23.11,22.99 23.62,23.5 v24.13,23.5 24.13,24.13 23.5,24.77 16.51,24.77 15.24,26.04 15.24,32.38 14.61,33.02 6.35,33.02 5.08,34.29 5.08,41.27 5.71,41.91
  Bottom 0.635: v68.58,45.09 67.94,45.09
  other vias: 67.94,48.9 8.26,54.61
  pour Bottom: 0,54.61 1.91,56.52 69.22,56.52 71.12,54.61 71.12,42.55 69.85,41.27 1.27,41.27 0,42.55
BLE_VCC
  Top 0.305: R1.1 R2.1 14.84,17.78 15.88,17.78 16.19,18.1 | U$1.17 12.79,21.61 C1.1 16.02,21.45 16.19,21.27 | 16.19,21.27 16.51,20.95 16.51,18.41 16.19,18.1 | C3.1 18.4,14.88 U$5.5 16.83,14.29 16.51,14.61 16.51,15.24 | 16.51,15.24 16.51,17.78 16.19,18.1 | U$1.8 13.14,14.41 13.97,15.24 16.51,15.24 | U$2.2 12.7,32.38 13.34,33.02 17.78,33.02 19.05,31.75 19.05,24.13 16.19,21.27
CELL1  (via drill 0.38)
  Top 0.305: R12.2 BATTERY.2 | v32.51,10.79 36.2,10.79 v36.83,9.91
  Bottom 0.203: 53.34,5.08 R30.1
  Bottom 0.305: BATTERY.2 67.94,28.57 68.58,27.94 68.58,21.59 67.94,20.95 67.94,12.7 67.31,12.06 34.29,12.06 33.02,10.79 v32.51,10.79 32.38,10.79 | v36.83,9.91 51.69,9.91 53.34,8.26 53.34,5.08
CELL2
  Top 0.305: R13.2 BATTERY.3
CELL3
  Top 0.305: R14.2 BATTERY.4
CELL4
  Top 0.305: R15.2 BATTERY.5
CHG  (via drill 0.38)
  Top 0.305: U$3.2 50.53,30.86 v48.9,30.86 | v26.67,34.92 27.49,35.75 Q3.2
  Bottom 0.305: v48.9,30.86 47.37,30.86 46.99,30.48 43.31,30.48 43.05,30.73 41.66,30.73 40.77,29.84 31.75,29.84 v26.67,34.92
DSG  (via drill 0.38)
  Top 0.305: U$3.1 49.53,31.5 49.15,31.88 v48.51,31.88 | v38.1,50.8 R22.1
  Top 0.406: R22.1 36.68,48.41 36.2,48.9 33.94,48.9 Q1.3A
  Bottom 0.305: v48.51,31.88 47.88,31.88 47.5,31.5 41.53,31.5 39.37,33.66 39.37,48.9 38.1,50.16 v38.1,50.8
ESC
  Top 0.254: JP2.3 3.81,30.48 2.54,29.21 2.54,26.67 4.32,24.89 4.32,23.3 U$1.24
GND  (via drill 0.38, 1.27 pad 3.17)
  Top 0.203: U$10.6 33.67,18.14 33.91,17.91 33.91,17.78 | 33.91,17.78 33.91,17.27 33.78,17.14 U$10.8 | v34.29,15.24 34.29,17.4 33.91,17.78 | 37.21,20.32 37.54,20.64 U$10.30 38.48,20.79 v38.42,21.65 | 37.21,20.32 37.21,19.94 37.51,19.64 U$10.28 | 37.59,18.16 37.21,17.78 37.21,17.4 37.47,17.14 U$10.23 U$10.22 U$10.21 | 37.59,18.16 38.32,18.16 U$10.25 | 37.21,20.32 37.21,21.34 v37.47,21.59 36.83,22.23 v36.83,26.67 | 37.59,18.16 37.21,18.16 36.83,17.78 v36.83,16.51 | C27.1 48.96,24.38 v50.86,24.38 50.86,22.92 50.16,22.23 50.16,20.57 51.31,19.43 52.84,19.43 C21.2 | v40.01,23.75 v40.01,25.65 | U$1.7 U$1.6 U$1.5 U$1.4 U$1.3 U$1.2 U$1.1 | v57.28,31.11 57.15,30.48 57.15,34.29 v55.88,35.56
  Top 0.305: R11.2 BATTERY.1 | R29.1 C29.2 | 52.7,40.64 53.34,40.64 | U$10.8 U$10.9 | Q7.2 22.16,19.75 19.68,22.23 19.68,22.86 | v48.9,37.47 48.07,36.64 C24.2 48.13,35.88 48.13,35.31 47.5,34.67 45.21,34.67 44.52,33.98 C23.1 43.56,33.72 v43.56,32.26 | U$1.25 2.35,22.41 1.27,23.5 1.27,31.75 0.64,32.38 0.64,36.83 JP1.3 | U$5.2 C2.2 | C27.1 48.26,22.86 v48.9,22.23 | U$2.1 12.02,25.36 v11.43,24.77 | v11.43,31.75 11.43,32.38 12.7,33.66 13.34,33.66 15.24,35.56 15.88,35.56 v16.51,34.92 | v20.95,30.48 21.59,30.48 | v31.5,10.92 31.5,10.29 31.37,10.16 31.37,8.89 31.62,8.64 33.02,8.64 33.53,8.13 33.53,6.58 33.02,6.07 S2.1 | U$3.3 49.38,30.2 49.28,30.1 48.51,30.1 47.12,31.5 46.1,31.5 v45.34,32.26
  Top 0.406: SP3.P$1 61.98,43.18 | SP4.P$1 63.75,43.18 | SP5.P$2 65.53,43.18 | SP6.P$1 67.31,43.18 | R20.2 47.3,36.7 C24.2 | SP1.P$1 44.45,54.61
  Bottom 0.203: v37.47,21.59 37.47,20.95 36.2,19.68 34.29,19.68 33.66,19.05 33.66,15.88 v34.29,15.24 | v36.83,16.51 36.83,19.56 37.21,19.94 37.63,19.94 U$10.30 38.34,21.32 v38.42,21.65 | C28.2 50.1,25.09 v50.86,24.38 | C33.1 40.64,23.11 v40.01,23.75 | v40.01,25.65 39.37,25.65 38.1,26.67 v36.83,26.67 | v55.88,35.56 54.61,34.29 54.61,33.02 | C15.1 61.91,31.43 60.96,32.38 59.05,32.38 58.42,31.75 58.42,31.11 v57.28,31.11
  Bottom 0.305: C20.1 C15.1 | v34.29,15.24 33.91,14.86 R53.1 R52.1 32.54,12.22 v31.5,10.92 | S2.1 33.93,6.07 35.56,4.45 38.1,4.45 38.73,5.08 38.73,5.99 S2.2 | R21.2 C26.2 52.07,34.29 v52.7,34.92 50.16,37.47 v48.9,37.47 | C30.2 8.26,34.92 v7.62,34.29 | 40.95,21.91 C33.1 C35.1 46.04,22.23 v48.9,22.23 | v11.43,24.77 11.43,26.04 12.7,27.3 12.7,30.48 v11.43,31.75 | v16.51,34.92 16.51,31.75 17.14,31.11 20.32,31.11 v20.95,30.48 | v45.34,32.26 v43.56,32.26
  other vias: 67.94,53.98
  pour Top: 43.81,56.52 43.18,55.88 43.18,41.91 43.81,41.27 70.48,41.27 71.12,41.91 71.12,55.88 70.48,56.52
  pour Top: 0,38.73 1.27,40.01 70.48,40.01 71.12,39.37 71.12,0.64 70.48,0 1.27,0 0,1.27
  pour Top: 52.07,41.91 52.07,39.37 53.98,39.37 53.98,41.91
N$1  (via drill 0.38)
  Top 0.305: U$1.34 4.42,15.21 5.08,15.88 5.08,20.32 5.71,20.95 v8.26,20.95 | v11.43,27.3 15.88,27.3 16.51,26.67 U$2.7
  Bottom 0.305: v8.26,20.95 8.26,23.5 10.79,26.04 10.79,26.67 v11.43,27.3
N$2
  Bottom 0.305: CN1.1 45.45,4.08 44.45,5.08 42.55,5.08 41.27,3.81 26.04,3.81 24.13,5.71 19.05,5.71 17.78,4.45 17.78,3.28 U$4.1
N$4
  Top 0.305: U$1.18 12.62,22.41 C1.2
N$7
  Top 0.305: R4.2 3.79,26.68 5.08,25.4 5.08,23.34 U$1.23
N$8
  Top 0.305: U$5.4 19.37,12.38 19.68,12.7 19.68,13.32 C2.1
N$9
  Top 0.305: R4.1 6.19,27.3 LED1.A
N$15
  Top 0.305: U$3.9 U$3.10
  Top 0.406: U$3.10 51.82,25.65 52.7,24.77 52.7,23.81 R18.1 52.39,21.79 C21.1
N$16  (via drill 0.38, 0.64 pad 1.27)
  Top 0.305: 45.72,46.99 45.09,46.99 44.45,46.35 44.45,41.27 v45.72,40.01 | C24.1 46.17,37.34 R20.1 | U$3.18 53.06,30.2 v52.07,29.21
  Top 0.406: v45.72,40.01 45.72,38.41 R20.1
  Bottom 0.305: v52.07,29.21 51.44,29.21 50.16,30.48 50.16,34.92 48.9,36.2 45.65,36.2 C22.2
  Bottom 0.406: C22.2 45.4,39.69 v45.72,40.01
N$17
  Top 0.406: R18.2 55.63,23.5 56.39,22.73 56.39,17.27 57.15,16.51 63.19,16.51 R17.1 D1.P$2
N$18  (via drill 0.38)
  Top 0.203: D11.2 55.63,39.75 54.61,38.73 52.07,38.73 50.16,36.83 50.16,35.56 48.64,34.04 45.47,34.04 45.09,33.66 45.09,33.02 44.45,32.38 44.45,30.54 R55.1 44.45,29.91 44.45,27.56 44.2,27.3 42.16,27.3 41.53,26.67 38.73,26.67 38.23,26.16 38.23,23.11 38.48,22.86 v38.48,22.61
  Bottom 0.203: R56.2 37.78,18.73 38.99,19.94 38.99,20.83 39.12,20.95 39.12,21.97 v38.48,22.61
N$19
  Top 0.305: R19.2 41.59,38.42 43.18,40.01 43.18,46.35 42.55,46.99 U$9.1
  Top 0.406: Q1.2C 37.54,45.01 R22.2 38.1,45.72 | C31.1 35.56,52.7
  pour Top: 33.66,41.91 33.66,55.88 34.29,56.52 41.91,56.52 42.55,55.88 42.55,41.91 41.91,41.27 34.29,41.27
N$20  (via drill 0.38, 0.64 pad 1.27)
  Top 0.305: U$3.19 52.34,30.85 52.07,31.11 52.07,31.75 50.8,33.02 47.62,33.02 v46.99,32.38
  Top 0.406: R19.1 43.81,37.78 C23.2 43.49,36.2 v41.27,36.2
  Bottom 0.305: v46.99,32.38 46.99,33.66 46.35,34.29 41.91,34.29 41.27,34.92 v41.27,36.2
  Bottom 0.406: C22.1 41.53,36.45 v41.27,36.2
N$21
  Top 0.305: U$3.7 48.88,27.6 C27.2
N$22  (via drill 0.38)
  Top 0.406: v37.47,38.73 37.47,42.42 R32.2
  Bottom 0.406: Q4.3 36.27,37.53 v37.47,38.73
N$23  (via drill 0.64 pad 1.27)
  Top 0.406: D4.P$2 13.34,38.73 v13.97,38.1
  Bottom 0.406: v13.97,38.1 13.59,38.1 12.57,39.12 10.86,39.12 R34.2
N$24  (via drill 0.38)
  Top 0.406: R33.2 29.21,35.56 v29.84,34.92
  Bottom 0.305: R34.1 12.38,37.15 13.34,36.2 28.57,36.2 v29.84,34.92
  Bottom 0.406: v29.84,34.92 29.84,35.89 D3.P$2 29.52,36.83 30.48,36.83 30.8,37.15 Q4.1
N$25
  Top 0.406: Q5.3 8.89,34.92 9.53,34.29 12.7,34.29 13.34,34.92 D4.P$1
N$27
  Top 0.406: D2.P$1 23.82,38.72 R25.2 22.71,40.01 R24.1
N$28
  pour Top: 21.59,41.91 21.59,55.88 22.23,56.52 32.38,56.52 33.02,55.88 33.02,41.91 32.38,41.27 22.23,41.27
N$29
  Top 0.406: C37.1 C36.2
N$30
  Top 0.305: R24.2 21.59,36.2 20.07,37.72 20.07,44.33 Q2.3A
  Top 0.406: R23.1 R24.2 22.38,35.26 D2.P$2
N$31
  Top 0.406: R25.1 26.54,39.18 Q3.3
N$32
  Bottom 0.203: S1.3 51.39,2.82 R30.2 55.29,2.82 S1.4
N$33  (via drill 0.38)
  Top 0.305: R29.2 C29.1 50.13,8.65 S1.1 S1.2 | U$3.6 50.47,28.32 47.5,28.32 46.99,27.81 46.99,22.86 51.44,18.41 v51.44,15.75 | v55.5,13.72 55.5,10.54 v56.52,9.53
  Bottom 0.305: v51.44,15.75 53.4,15.75 v55.5,13.72 | v56.52,9.53 56.52,6.15 S1.2
N$35
  Top 0.406: C32.1 C31.2
N$36  (via drill 0.38)
  Top 0.203: U$10.27 39.21,19.14 39.5,19.43 39.5,22.99 v38.92,23.62
  Bottom 0.203: v38.92,23.62 38.92,23.5 39.5,22.86 39.5,20.45 40.01,19.94 40.57,19.94 C33.2
N$37  (via drill 0.38)
  Top 0.305: U$10.5 32.03,18.64 31.11,19.56 31.11,20.32 29.84,21.59 29.84,31.11 27.3,33.66 15.88,33.66 v15.24,34.29 | v11.43,35.56 R35.2
  Bottom 0.305: v15.24,34.29 12.7,34.29 v11.43,35.56
N$38  (via drill 0.38)
  Top 0.305: U$10.24 39.62,17.64 v40.01,18.03
  Bottom 0.305: v40.01,18.03 41.97,18.03 R36.1
N$39  (via drill 0.38)
  Top 0.305: Q7.3 21.59,22.86 v22.23,23.5
  Bottom 0.305: R46.1 22.86,18.73 22.86,19.56 22.61,19.81 22.61,23.11 v22.23,23.5
N$40
  Top 0.203: U$10.20 41.27,15.64 LED8.C
N$41
  Top 0.203: U$10.19 39.85,15.14 40.39,14.61 42.29,14.61 42.67,14.99 LED7.C
N$42
  Top 0.203: U$10.18 39.58,14.64 40.26,13.97 43.56,13.97 44.07,14.48 LED6.C
N$43
  Top 0.203: U$10.17 39.2,14.14 40.01,13.34 44.7,13.34 45.47,14.1 LED5.C
N$44
  Top 0.203: U$10.16 39.06,13.64 40.01,12.7 45.47,12.7 46.86,14.1 LED4.C
N$45
  Top 0.203: R40.1 LED4.A
N$46
  Top 0.203: R41.1 LED5.A
N$47
  Top 0.203: R39.1 LED6.A
N$48
  Top 0.203: R38.1 LED7.A
N$49
  Top 0.203: R37.1 LED8.A
N$50
  Top 0.305: R43.2 26.35,19.51 C34.1 25.92,20.21 26.67,20.95 28.38,20.95 R42.1 29.28,20.89 30.48,19.68 30.48,19.18 32,17.65 32.78,17.65 U$10.7
N$51  (via drill 0.38)
  Top 0.203: U$10.12 30.13,15.14 29.97,14.99 27.56,14.99 26.04,16.51 22.1,16.51 21.72,16.89 21.72,17.02 21.59,17.14 21.59,19.3 21.21,19.68 20.71,19.68 Q7.1
  Top 0.305: Q7.1 20.25,19.75 v18.41,21.59
  Bottom 0.305: v18.41,21.59 R44.2
N$52  (via drill 0.38)
  Top 0.305: R42.2 28.45,17.91 v28.57,17.78
  Bottom 0.305: v28.57,17.78 28.57,18.41 27.94,19.05 26.85,19.05 Q6.3
N$53  (via drill 0.38)
  Top 0.305: v18.41,18.41 R45.1
  Bottom 0.305: R45.1 v18.41,18.41 18.41,17.78 19.05,17.14 24.13,17.14 24.33,17.34 Q6.1
N$54
  Top 0.305: U$10.13 31.48,14.64 R48.1
N$55  (via drill 0.38)
  Top 0.203: U$10.14 35.64,14.14 36.2,13.59 v36.96,13.59 | v53.34,13.59 53.34,10.79 v54.61,9.53 | v54.61,7.56 52.13,7.56 v51.44,8.26
  Top 0.305: v36.2,5.21 36.2,2.54 37.85,1.52 38.79,1.52 S2.4 S2.3
  Bottom 0.203: v36.96,13.59 v53.34,13.59 | v54.61,9.53 v54.61,7.56 | v51.44,8.26 49.53,8.26 48.9,7.62 37.78,7.62 R47.1
  Bottom 0.305: R47.1 36.26,7.18 v36.2,5.21
N$56
  Top 0.305: U$10.11 29.37,15.64 R49.1
N$57  (via drill 0.38)
  Top 0.305: D5.2 58.67,35.31 60.33,33.66 64.77,33.66 66.04,32.38 67.31,32.38 67.94,31.75 67.94,22.86 v67.31,22.23 | v30.48,10.16 30.48,10.79 29.34,11.94 R50.1 30.67,11.94 R48.2 32.7,12.38 33.02,12.06 46.35,12.06 48.9,14.61 60.96,14.61 62.87,12.7 64.77,12.7 v65.41,13.34
  Bottom 0.305: 29.84,12.7 R52.2 30.48,11.91 v30.48,10.16 | v67.31,22.23 67.31,13.34 66.67,12.7 66.04,12.7 v65.41,13.34
N$58  (via drill 0.38)
  Top 0.305: D6.2 60.2,36.96 61.59,35.56 64.77,35.56 66.67,33.66 67.94,33.66 68.71,32.83 v68.71,20.32 | v68.71,17.21 68.71,12.76 64.14,8.26 52.7,8.26 49.53,11.43 41.27,11.43 34.92,5.08 34.92,4.45 34.29,3.81 28.57,3.81 25.4,6.99 25.4,12.7 | 25.4,12.7 26.67,13.97 | 26.67,13.97 29.02,13.97 R49.2 | R51.1 23.56,14.54 25.4,12.7 | v25.4,15.24 26.67,13.97
  Bottom 0.305: v68.71,20.32 v68.71,17.21 | R53.2 25.78,14.86 v25.4,15.24
N$59  (via drill 0.38)
  Top 0.203: D10.2 57.15,39.62 55.63,38.1 52.07,38.1 50.8,36.83 50.8,35.56 48.9,33.66 46.61,33.66 v45.97,33.02 | v41.91,32.38 40.01,32.38 39.37,31.75 39.37,28.38 R54.1 37.53,26.54 v37.53,23.11
  Bottom 0.203: v45.97,33.02 42.55,33.02 v41.91,32.38 | R57.2 36.58,22.23 v37.53,23.11
P2_1  (via drill 0.38)
  Top 0.305: U$1.10 11.95,16.02 v12.45,16.51 | v13.97,31.75 U$2.4
  Bottom 0.305: v12.45,16.51 12.45,25.78 13.97,27.3 v13.97,31.75
P2_2  (via drill 0.38)
  Top 0.305: U$2.3 13.97,22.86 v14.61,22.23 | v12.7,15.24 10.35,15.24 U$1.9
  Bottom 0.305: v14.61,22.23 14.61,17.14 v12.7,15.24
PACK-  (via drill 0.38, 1.27 pad 3.17)
  Top 0.406: Q2.2C 20.75,52.17 C32.2 | SP2.P$1 3.17,43.81 3.81,43.18 5.39,43.18 C36.1 | SP1.P$2 19.05,54.61 | R33.1 29.21,39.37 v27.43,37.47 | D8.P$1 17.14,40.16 R23.2 17.63,38.1 v15.88,38.1
  Bottom 0.406: Q4.2 32.64,40 32.64,40.64 32,41.27 29.84,41.27 29.21,40.64 D3.P$1 27.3,37.77 v27.43,37.47 16.51,37.47 v15.88,38.1
  other vias: 3.17,54.61
  pour Top: 0,42.55 1.27,41.27 19.68,41.27 20.95,42.55 20.95,55.24 19.68,56.52 1.91,56.52 0,54.61
PRECHARGE_CONTROL
  Top 0.406: Q5.1 11.18,39.3 R35.1
REG_IN
  Top 0.305: U$5.1 14.03,14.29 13.72,13.97 13.72,12.7 | 13.72,12.7 C4.1 | 13.72,12.7 14.03,12.38 U$5.3 15.24,12.36 15.24,11.43 16.51,10.16 17.14,10.16 19.68,7.62 U$4.2
REGOUT  (via drill 0.38, 0.64 pad 1.27)
  Top 0.203: R38.2 R37.2 41.26,20.45 40.64,20.45 40.13,19.94 40.13,19.3 39.47,18.64 U$10.26 | R38.2 R39.2 R41.2 | R41.2 R40.2 | 42.93,20.72 R38.2 | R41.2 45.47,21.21 45.72,21.46 47.5,21.46 48.01,20.95 v48.01,19.68
  Top 0.254: 42.93,20.72 v42.93,22.73
  Top 0.305: U$3.8 51.72,26.95 v52.07,27.3 | R27.1 R26.1 43.18,22.99 v42.93,22.73 | U$10.26 37.62,18.64 36.32,19.94 36.32,24.64 v35.56,25.4 | v34.92,6.35 34.92,5.97 33.66,4.7 28.96,4.7 v27.56,6.1 | U$4.3 21.69,8.36 v22.23,8.89
  Top 0.406: Q5.2 6.92,39.3 v6.35,38.73
  Bottom 0.203: v48.01,19.68 46.04,19.68 C35.2
  Bottom 0.254: R36.2 43.64,20.89 R39.2 44.07,18.8 44.45,18.41 47.56,18.41 48.01,18.86 v48.01,19.68
  Bottom 0.305: v52.07,27.3 52.7,27.3 | R47.2 35.24,6.67 v34.92,6.35 | 27.3,6.35 v27.56,6.1 24.77,8.89 v22.23,8.89
  Bottom 0.406: v6.35,38.73 7.94,38.73 C30.1
  pour Bottom: 0,38.73 1.27,40.01 69.85,40.01 71.12,38.73 71.12,1.27 69.85,0 1.27,0 0,1.27
SCL  (via drill 0.38)
  Top 0.305: U$16.2 26.67,3.17 v22.86,6.99 | v7.43,19.05 10.16,19.05 U$1.14 10.35,19.19 R1.2 | JP1.1 1.91,25.4 v3.17,24.13
  Bottom 0.305: v22.86,6.99 11.43,6.99 10.16,8.26 10.16,16.51 v7.43,19.05 7.43,21.65 5.08,24.13 v3.17,24.13
SCL_
  Top 0.305: R55.2 46.03,28.57 R27.2 46.37,28.9 U$3.5
SCL_BMS  (via drill 0.38)
  Top 0.203: U$10.4 33.69,19.14 v34.42,18.41
  Top 0.305: SP4.P$2 63.75,36.58 v64.14,36.51
  Bottom 0.203: v34.42,18.41 R56.1
  Bottom 0.305: v64.14,36.51 64.14,13.97 62.87,12.7 36.2,12.7 35.56,13.34 35.56,18.09 R56.1
SDA  (via drill 0.38)
  Top 0.305: R2.2 14.73,19.56 14.22,20.07 10.38,20.07 U$1.15 6.68,20.02 v6.35,19.68 | v30.48,2.54 29.72,2.54 U$17.2
  Bottom 0.305: v30.48,2.54 29.21,1.27 12.7,1.27 9.53,4.45 9.53,15.24 6.35,18.41 v6.35,19.68 1.91,24.13 1.91,29.84 3.17,31.11 3.17,34.29 JP1.2
SDA_  (via drill 0.38)
  Top 0.305: R54.2 43.11,28.32 R26.2 43.18,29.21 v42.55,29.84 | U$3.4 47.92,29.55 v47.62,29.84
  Bottom 0.305: v47.62,29.84 v42.55,29.84
SDA_BMS  (via drill 0.38)
  Top 0.203: U$10.3 33.87,19.64 v34.29,20.57
  Top 0.305: SP3.P$2 61.98,37.08 v62.67,36.39 | v34.29,20.57 34.54,20.32 34.92,19.81 35.56,19.05 35.56,15.24 36.2,14.61 v36.83,14.61
  Bottom 0.305: v62.67,36.39 63.5,35.56 63.5,17.14 62.87,16.51 38.73,16.51 v36.83,14.61 | v34.29,20.57 34.29,21.91 R57.1
SMBC  (via drill 0.38)
  Top 0.305: SP6.P$2 67.31,36.83 v67.94,36.2 | v31.75,7.62 27.3,7.62 26.67,8.26 U$16.1 26.67,11.24 R50.2
  Bottom 0.305: v67.94,36.2 69.85,36.2 70.48,35.56 70.48,12.06 69.22,10.79 35.56,10.79 v31.75,7.62
SMBD  (via drill 0.38)
  Top 0.305: SP5.P$1 65.53,36.07 v66.67,34.92 | v30.48,8.89 30.04,8.89 U$17.1 | R51.2 23.56,12.64 v24.13,12.06
  Bottom 0.305: v66.67,34.92 69.22,34.92 69.85,34.29 69.85,12.7 68.58,11.43 34.92,11.43 31.75,8.89 v30.48,8.89 27.3,12.06 v24.13,12.06
VC0  (via drill 0.38)
  Top 0.305: U$3.17 57.62,29.55 58.04,29.97 58.04,30.73 58.42,31.11 | 58.42,31.11 R11.1 | v57.85,32.38 57.85,31.75 58.42,31.11
  Bottom 0.305: C20.2 59.05,33.66 v57.85,32.38
VC1  (via drill 0.38)
  Top 0.305: 59.21,28.9 R12.1 59.16,28.96 v58.17,28.96 58.11,28.9 U$3.16
  Bottom 0.305: C15.2 C16.2 60.07,28.57 59.69,28.96 v58.17,28.96
VC2  (via drill 0.38)
  Top 0.203: v58.42,25.78 58.93,25.97 58.93,26.42
  Top 0.305: U$3.15 57.86,28.25 58.93,27.18 58.93,26.42 59.31,26.04 R13.1 59.69,26.04
  Bottom 0.203: C17.2 58.93,25.97 v58.42,25.78
  Bottom 0.305: C16.1 61.91,27.62 61.59,27.3 60.96,27.3 60.01,26.36
  Bottom 0.406: C17.2 60.01,26.36
VC3  (via drill 0.38)
  Top 0.305: U$3.14 57.24,27.6 57.53,27.3 57.53,23.88 v57.91,23.5
  Top 0.406: R14.1 v57.91,23.5
  Bottom 0.305: 61.85,25.97 61.85,25.02 61.59,24.77 60.33,24.77 | v57.91,23.5 57.53,23.88 57.53,24.26 58.04,24.77 60.33,24.77 | C18.2 60.01,24.45 60.33,24.77
  Bottom 0.406: 61.85,25.97 C17.1
VC4  (via drill 0.38)
  Top 0.305: U$3.13 56.87,26.95 57.02,26.8 57.02,21.72 v57.78,20.95 R15.1
  Bottom 0.305: 61.85,23.43 61.85,22.48 61.47,22.1 60.33,22.1 60.01,21.78 C19.2 v57.78,20.95
  Bottom 0.406: 61.85,23.43 C18.1
VC5  (via drill 0.38)
  Top 0.305: R16.1 61.28,18.41 | U$3.12 54.88,26.3 v54.61,26.04
  Top 0.406: 61.28,18.41 v61.4,18.54
  Bottom 0.305: v61.4,18.54 61.4,19.24 61.15,19.49 | 61.15,19.49 61.34,19.68 61.72,19.68 61.98,19.94 61.98,20.89 | v54.61,26.04 54.61,21.21 56.07,19.75 60.9,19.75 61.15,19.49
  Bottom 0.406: 61.98,20.89 C19.1

### Text on the board
tPlace: BAT+ | PACK- | GND | BAT+ | GND | SDA | SCL | GND | LEDS | RESET | BATT | BMS